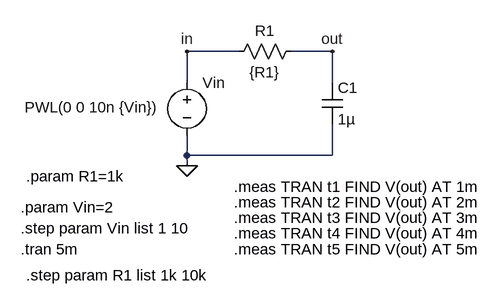
[diagram p0: schematic TRAN - STEP.asc]
TRAN - STEP.asc, the LTspice schematic file:
Version 4
SHEET 1 880 680
WIRE 160 96 80 96
WIRE 304 96 240 96
WIRE 80 144 80 96
WIRE 304 144 304 96
WIRE 80 256 80 224
WIRE 304 256 304 208
WIRE 304 256 80 256
WIRE 80 272 80 256
FLAG 80 272 0
FLAG 80 96 in
FLAG 304 96 out
SYMBOL voltage 80 128 R0
WINDOW 3 -250 54 Left 2
WINDOW 123 0 0 Left 0
WINDOW 39 0 0 Left 0
SYMATTR Value PWL(0 0 10n {Vin})
SYMATTR InstName Vin
SYMBOL res 144 112 R270
WINDOW 0 32 56 VTop 2
WINDOW 3 0 56 VBottom 2
SYMATTR InstName R1
SYMATTR Value {R1}
SYMBOL cap 288 144 R0
SYMATTR InstName C1
SYMATTR Value 1µ
TEXT -176 400 Left 2 !.tran 5m
TEXT -176 368 Left 2 !.step param Vin list 1 10
TEXT -176 336 Left 2 !.param Vin=2
TEXT -168 288 Left 2 !.param R1=1k
TEXT -168 440 Left 2 !.step param R1 list 1k 10k
TEXT 152 304 Left 2 !.meas TRAN t1 FIND V(out) AT 1m
TEXT 152 328 Left 2 !.meas TRAN t2 FIND V(out) AT 2m
TEXT 152 352 Left 2 !.meas TRAN t3 FIND V(out) AT 3m
TEXT 152 376 Left 2 !.meas TRAN t4 FIND V(out) AT 4m
TEXT 152 400 Left 2 !.meas TRAN t5 FIND V(out) AT 5m

The netlist it stands for:
* TRAN - STEP.asc
Vin in 0 PWL(0 0 10n {Vin})
R1 in out {R1}
C1 out 0 1µ
.tran 5m
.step param Vin list 1 10
.param Vin=2
.param R1=1k
.step param R1 list 1k 10k
.meas TRAN t1 FIND V(out) AT 1m
.meas TRAN t2 FIND V(out) AT 2m
.meas TRAN t3 FIND V(out) AT 3m
.meas TRAN t4 FIND V(out) AT 4m
.meas TRAN t5 FIND V(out) AT 5m
.backanno
.end